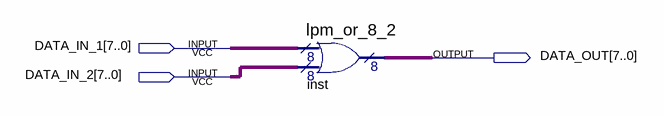
[diagram p0: schematic sheet]
// Quartus schematic oper_or.bdf as structural Verilog: 1 symbols, 3 pins
module oper_or (
  input  [7:0] DATA_IN_1,
  input  [7:0] DATA_IN_2,
  output [7:0] DATA_OUT
);

  lpm_or_8_2 inst (.data0x(DATA_IN_1), .data1x(DATA_IN_2), .result(DATA_OUT));
endmodule
